# EAGLE schematic ArduinoInterface_v3.1 (EAGLE 9.2.1)
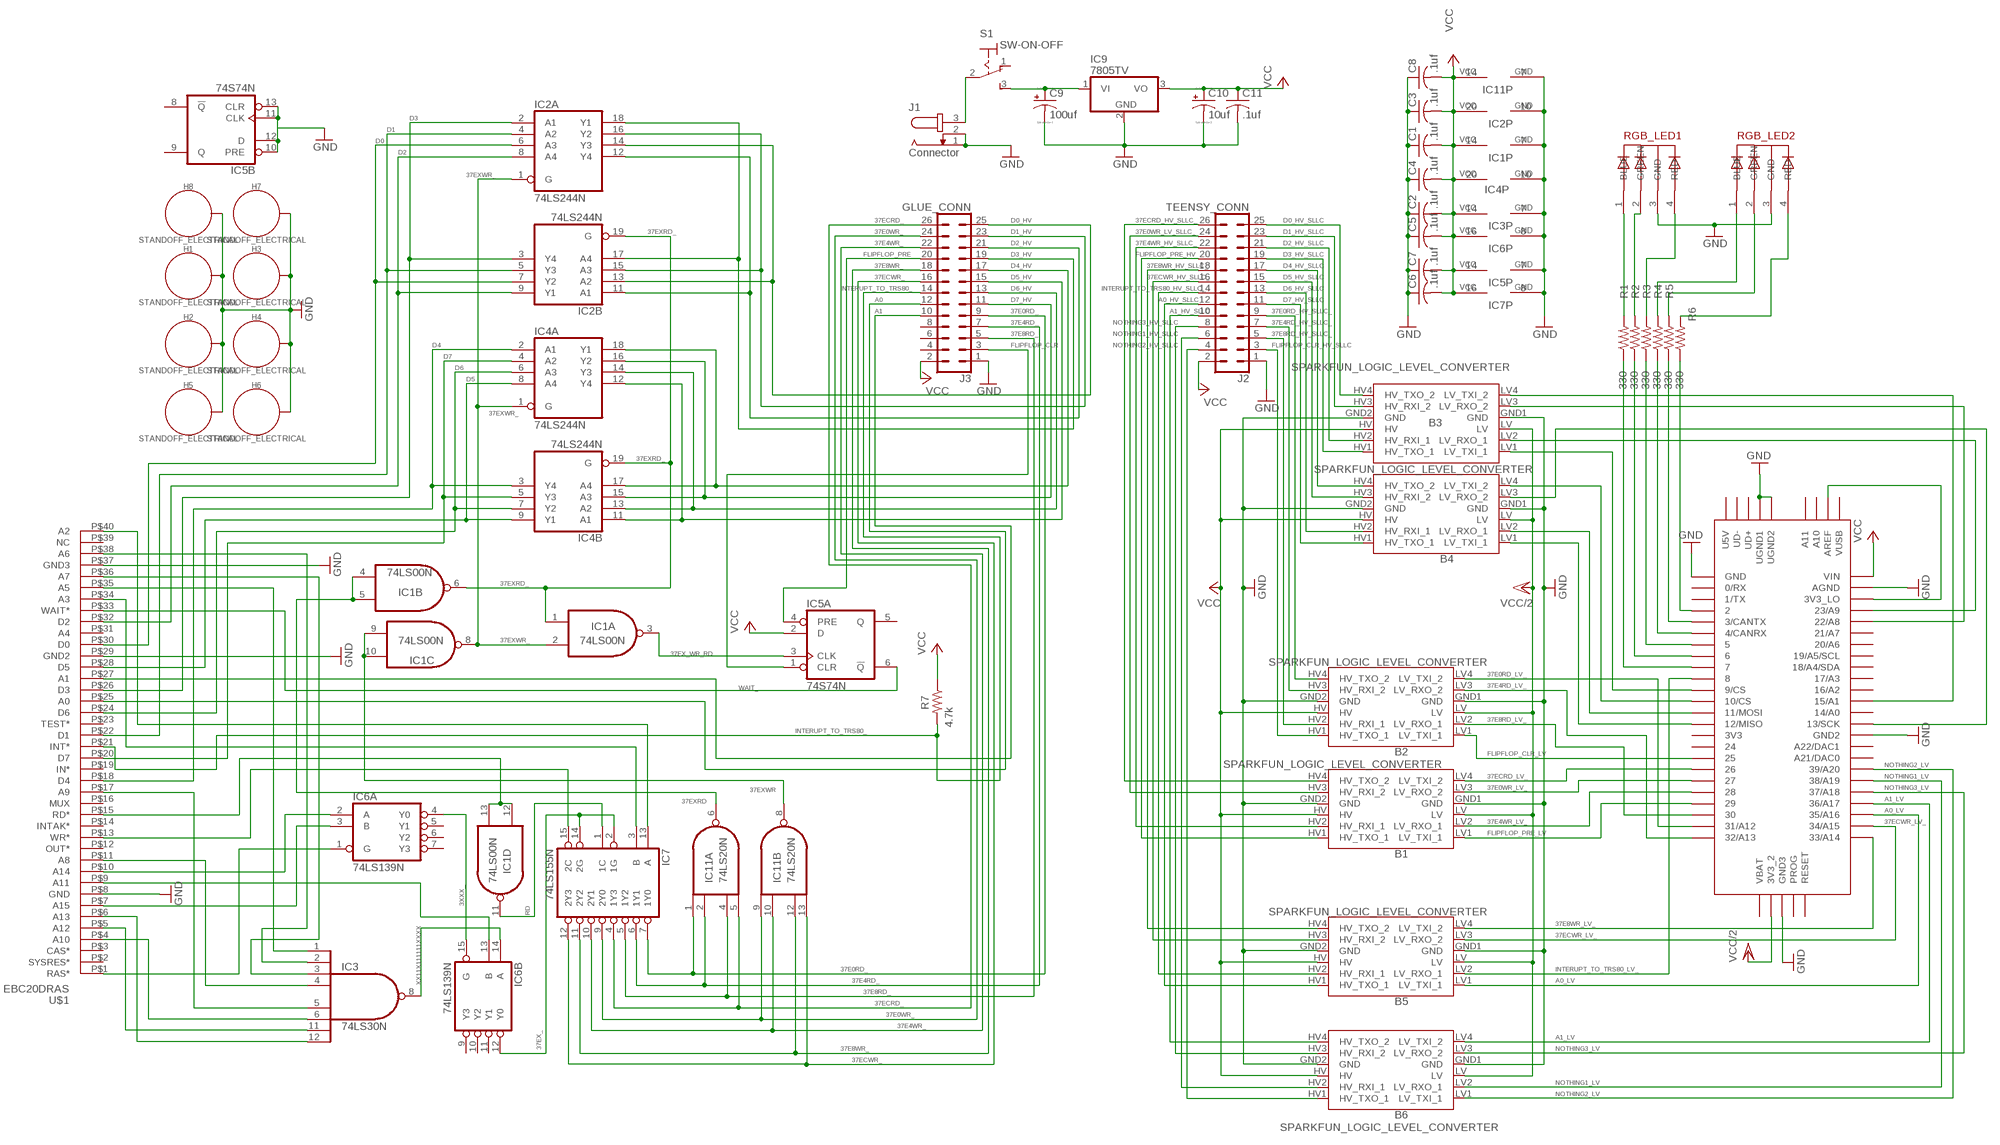
[diagram p0: schematic, sheet 1]

## Parts
B1  SPARKFUN_LOGIC_LEVEL_CONVERTER  [SPARKFUN_LOGIC_LEVEL_CONVERTER]
B2  SPARKFUN_LOGIC_LEVEL_CONVERTER  [SPARKFUN_LOGIC_LEVEL_CONVERTER]
B3  SPARKFUN_LOGIC_LEVEL_CONVERTER  [SPARKFUN_LOGIC_LEVEL_CONVERTER]
B4  SPARKFUN_LOGIC_LEVEL_CONVERTER  [SPARKFUN_LOGIC_LEVEL_CONVERTER]
B5  SPARKFUN_LOGIC_LEVEL_CONVERTER  [SPARKFUN_LOGIC_LEVEL_CONVERTER]
B6  SPARKFUN_LOGIC_LEVEL_CONVERTER  [SPARKFUN_LOGIC_LEVEL_CONVERTER]
C1  .1uf  C-US025-025X050  [C025-025X050]
C2  .1uf  C-US025-025X050  [C025-025X050]
C3  .1uf  C-US025-025X050  [C025-025X050]
C4  .1uf  C-US025-025X050  [C025-025X050]
C5  .1uf  C-US025-025X050  [C025-025X050]
C6  .1uf  C-US025-025X050  [C025-025X050]
C7  .1uf  C-US025-025X050  [C025-025X050]
C8  .1uf  C-US025-025X050  [C025-025X050]
C9  100uf  CPOL-USE5-6  [E5-6]
C10  10uf  CPOL-USE5-6  [E5-6]
C11  .1uf  C-US025-025X050  [C025-025X050]
H1  STANDOFF_ELECTRICAL  [STANDOFF-ELECTRICAL]
H2  STANDOFF_ELECTRICAL  [STANDOFF-ELECTRICAL]
H3  STANDOFF_ELECTRICAL  [STANDOFF-ELECTRICAL]
H4  STANDOFF_ELECTRICAL  [STANDOFF-ELECTRICAL]
H5  STANDOFF_ELECTRICAL  [STANDOFF-ELECTRICAL]
H6  STANDOFF_ELECTRICAL  [STANDOFF-ELECTRICAL]
H7  STANDOFF_ELECTRICAL  [STANDOFF-ELECTRICAL]
H8  STANDOFF_ELECTRICAL  [STANDOFF-ELECTRICAL]
IC1  74LS00N  [DIL14]
IC2  74LS244N  [DIL20]
IC3  74LS30N  [DIL14]
IC4  74LS244N  [DIL20]
IC5  74S74N  [DIL14]
IC6  74LS139N  [DIL16]
IC7  74LS155N  [DIL16]
IC9  7805TV  [TO220V]
IC11  74LS20N  [DIL14]
J1  Connector  JACK-PLUG0  [SPC4077]
J2  TEENSY_CONN  CONN_13X22X13  [2X13]
J3  GLUE_CONN  CONN_13X22X13  [2X13]
R1  330  R-US_0204/2V  [0204V]
R2  330  R-US_0204/2V  [0204V]
R3  330  R-US_0204/2V  [0204V]
R4  330  R-US_0204/2V  [0204V]
R5  330  R-US_0204/2V  [0204V]
R6  330  R-US_0204/2V  [0204V]
R7  4.7k  R-US_0204/2V  [0204V]
RGB_LED1  5MMRGBLED  [LED5MMRGB]
RGB_LED2  5MMRGBLED  [LED5MMRGB]
S1  SW-ON-OFF  M9040P  [M9040P]
U$1  EBC20DRAS  [EBC20DRAS]
U$2  TEENSY_3.5/3.6  [TEENSY_3.5/3.6]

## Nets
3XXX_: IC6.4(A:Y0) IC6.15(B:G)
9V: C9.+ IC9.1(VI) S1.3(S)
9V_TO_SW: J1.3 S1.2(P)
37E0RD_: IC7.7(1Y0) IC11.1(A:I0) J3.9
37E0RD_HV_SLLC_: B2.HV4(HV_TXO_2) J2.9
37E0RD_LV_: B2.LV4(LV_TXI_2) U$2.31/A12
37E0WR_: IC7.9(2Y0) IC11.9(B:I0) J3.24
37E0WR_LV_: B1.LV3(LV_RXO_2) U$2.27
37E0WR_LV_SLLC_: B1.HV3(HV_RXI_2) J2.24
37E4RD_: IC7.6(1Y1) IC11.2(A:I1) J3.7
37E4RD_HV_SLLC_: B2.HV3(HV_RXI_2) J2.7
37E4RD_LV_: B2.LV3(LV_RXO_2) U$2.32/A13
37E4WR_: IC7.10(2Y1) IC11.10(B:I1) J3.22
37E4WR_HV_SLLC_: B1.HV2(HV_RXI_1) J2.22
37E4WR_LV_: B1.LV2(LV_RXO_1) U$2.28
37E8RD_: IC7.5(1Y2) IC11.4(A:I2) J3.5
37E8RD_HV_SLLC_: B2.HV2(HV_RXI_1) J2.5
37E8RD_LV_: B2.LV2(LV_RXO_1) U$2.30
37E8WR_: IC7.11(2Y2) IC11.12(B:I2) J3.18
37E8WR_HV_SLLC_: B5.HV4(HV_TXO_2) J2.18
37E8WR_LV_: B5.LV4(LV_TXI_2) U$2.33/A14
37ECRD_: IC7.4(1Y3) IC11.5(A:I3) J3.26
37ECRD_HV_SLLC_: B1.HV4(HV_TXO_2) J2.26
37ECRD_LV_: B1.LV4(LV_TXI_2) U$2.26
37ECWR_: IC7.12(2Y3) IC11.13(B:I3) J3.16
37ECWR_HV_SLLC_: B5.HV3(HV_RXI_2) J2.16
37ECWR_LV_: B5.LV3(LV_RXO_2) U$2.34/A15
37EX_: IC6.12(B:Y0) IC7.2(1G) IC7.14(2G)
37EX_WR_RD: IC1.3(A:O) IC5.3(A:CLK)
37EXRD: IC1.4(B:I0) IC1.5(B:I1) IC11.6(A:O)
37EXRD_: IC1.1(A:I0) IC1.6(B:O) IC2.19(B:G) IC4.19(B:G)
37EXWR: IC1.9(C:I0) IC1.10(C:I1) IC11.8(B:O)
37EXWR_: IC1.2(A:I1) IC1.8(C:O) IC2.1(A:G) IC4.1(A:G)
A0: J3.12 U$1.P$25(A0)
A0_HV_SLLC: B5.HV1(HV_TXO_1) J2.12
A0_LV: B5.LV1(LV_TXI_1) U$2.35/A16
A1: J3.10 U$1.P$27(A1)
A1_HV_SLLC: B6.HV4(HV_TXO_2) J2.10
A1_LV: B6.LV4(LV_TXI_2) U$2.36/A17
A2: IC7.13(A) U$1.P$40(A2)
A3: IC7.3(B) U$1.P$34(A3)
A5: IC3.1(I0) U$1.P$35(A5)
A6: IC3.2(I1) U$1.P$38(A6)
A7: IC3.3(I2) U$1.P$36(A7)
A8: IC3.4(I3) U$1.P$11(A8)
A9: IC3.5(I4) U$1.P$17(A9)
A10: IC3.6(I5) U$1.P$4(A10)
A11: IC6.13(B:B) U$1.P$9(A11)
A12: IC3.11(I6) U$1.P$5(A12)
A13: IC3.12(I7) U$1.P$6(A13)
A14: IC6.2(A:A) U$1.P$10(A14)
A15: IC6.3(A:B) U$1.P$7(A15)
D0: IC2.6(A:A3) IC2.7(B:Y2) U$1.P$30(D0)
D0_HV: IC2.13(B:A2) IC2.14(A:Y3) J3.25
D0_HV_SLLC: B3.HV4(HV_TXO_2) J2.25
D0_LV: B3.LV4(LV_TXI_2) U$2.15/A1
D1: IC2.4(A:A2) IC2.5(B:Y3) U$1.P$22(D1)
D1_HV: IC2.15(B:A3) IC2.16(A:Y2) J3.23
D1_HV_SLLC: B3.HV3(HV_RXI_2) J2.23
D1_LV: B3.LV3(LV_RXO_2) U$2.22/A8
D2: IC2.8(A:A4) IC2.9(B:Y1) U$1.P$32(D2)
D2_HV: IC2.11(B:A1) IC2.12(A:Y4) J3.21
D2_HV_SLLC: B3.HV2(HV_RXI_1) J2.21
D2_LV: B3.LV2(LV_RXO_1) U$2.23/A9
D3: IC2.2(A:A1) IC2.3(B:Y4) U$1.P$26(D3)
D3_HV: IC2.17(B:A4) IC2.18(A:Y1) J3.19
D3_HV_SLLC: B3.HV1(HV_TXO_1) J2.19
D3_LV: B3.LV1(LV_TXI_1) U$2.9/CS
D4: IC4.2(A:A1) IC4.3(B:Y4) U$1.P$18(D4)
D4_HV: IC4.17(B:A4) IC4.18(A:Y1) J3.17
D4_HV_SLLC: B4.HV4(HV_TXO_2) J2.17
D4_LV: B4.LV4(LV_TXI_2) U$2.10/CS
D5: IC4.8(A:A4) IC4.9(B:Y1) U$1.P$28(D5)
D5_HV: IC4.11(B:A1) IC4.12(A:Y4) J3.15
D5_HV_SLLC: B4.HV3(HV_RXI_2) J2.15
D5_LV: B4.LV3(LV_RXO_2) U$2.13/SCK
D6: IC4.6(A:A3) IC4.7(B:Y2) U$1.P$24(D6)
D6_HV: IC4.13(B:A2) IC4.14(A:Y3) J3.13
D6_HV_SLLC: B4.HV2(HV_RXI_1) J2.13
D6_LV: B4.LV2(LV_RXO_1) U$2.11/MOSI
D7: IC4.4(A:A2) IC4.5(B:Y3) U$1.P$20(D7)
D7_HV: IC4.15(B:A3) IC4.16(A:Y2) J3.11
D7_HV_SLLC: B4.HV1(HV_TXO_1) J2.11
D7_LV: B4.LV1(LV_TXI_1) U$2.12/MISO
FLIPFLOP_CLR: IC5.1(A:CLR) J3.3
FLIPFLOP_CLR_HV_SLLC: B2.HV1(HV_TXO_1) J2.3
FLIPFLOP_CLR_LV: B2.LV1(LV_TXI_1) U$2.25
FLIPFLOP_PRE: IC5.4(A:PRE) J3.20
FLIPFLOP_PRE_HV: B1.HV1(HV_TXO_1) J2.20
FLIPFLOP_PRE_LV: B1.LV1(LV_TXI_1) U$2.29
GND: B1.GND1(GND) B1.GND2(GND) B2.GND1(GND) B2.GND2(GND) B3.GND1(GND) B3.GND2(GND) B4.GND1(GND) B4.GND2(GND) B5.GND1(GND) B5.GND2(GND) B6.GND1(GND) B6.GND2(GND) C1.1 C2.1 C3.1 C4.1 C5.1 C6.1 C7.1 C8.1 C9.- C10.- C11.2 H1.P1 H2.P1 H3.P1 H4.P1 H5.P1 H6.P1 H7.P1 H8.P1 IC1.7(P:GND) IC2.10(P:GND) IC3.7(GND) IC4.10(P:GND) IC5.7(P:GND) IC5.10(B:PRE) IC5.11(B:CLK) IC5.12(B:D) IC5.13(B:CLR) IC6.8(P:GND) IC7.8(GND) IC9.2(GND) IC11.7(P:GND) J1.1 J1.2 J2.1 J3.1 RGB_LED1.3(GND) RGB_LED2.3(GND) U$1.P$8(GND) U$1.P$29(GND2) U$1.P$37(GND3) U$2.AGND U$2.GND U$2.GND2 U$2.GND3 U$2.UGND1 U$2.UGND2
INTERUPT_TO_TRS80_: J3.14 R7.2 U$1.P$21(INT*)
INTERUPT_TO_TRS80_HV_SLLC_: B5.HV2(HV_RXI_1) J2.14
INTERUPT_TO_TRS80_LV_: B5.LV2(LV_RXO_1) U$2.8
N$1: U$2.3V3_LO U$2.AREF
N$2: R2.2 RGB_LED1.2(GREEN)
N$3: R6.1 U$2.2
N$4: R5.1 U$2.3/CANTX
N$5: R4.1 U$2.4/CANRX
N$6: R3.1 U$2.5
N$7: R2.1 U$2.6
N$8: R1.1 U$2.7
N$10: R1.2 RGB_LED1.1(BLUE)
N$15: R3.2 RGB_LED1.4(RED)
N$19: R4.2 RGB_LED2.1(BLUE)
N$20: R5.2 RGB_LED2.2(GREEN)
N$21: R6.2 RGB_LED2.4(RED)
NOTHING1_HV_SLLC: B6.HV2(HV_RXI_1) J2.6
NOTHING1_LV: B6.LV2(LV_RXO_1) U$2.38/A19
NOTHING2_HV_SLLC: B6.HV1(HV_TXO_1) J2.4
NOTHING2_LV: B6.LV1(LV_TXI_1) U$2.39/A20
NOTHING3_HV_SLLC: B6.HV3(HV_RXI_2) J2.8
NOTHING3_LV: B6.LV3(LV_RXO_2) U$2.37/A18
RAS_: IC6.1(A:G) U$1.P$1(RAS*)
RD: IC1.11(D:O) IC7.1(1C)
RD_: IC1.12(D:I0) IC1.13(D:I1) U$1.P$15(RD*)
VCC: B1.HV B2.HV B3.HV B4.HV B5.HV B6.HV C1.2 C2.2 C3.2 C4.2 C5.2 C6.2 C7.2 C8.2 C10.+ C11.1 IC1.14(P:VCC) IC2.20(P:VCC) IC3.14(VCC) IC4.20(P:VCC) IC5.2(A:D) IC5.14(P:VCC) IC6.16(P:VCC) IC7.16(VCC) IC9.3(VO) IC11.14(P:VCC) J2.2 J3.2 R7.1 U$2.VIN
VCC/2: B1.LV B2.LV B3.LV B4.LV B5.LV B6.LV U$2.3V3_2
WAIT_: IC5.6(A:!Q) U$1.P$33(WAIT*)
WR_: IC7.15(2C) U$1.P$13(WR*)
XX11X111111XXXX: IC3.8(O) IC6.14(B:A)
Unconnected: IC5.5(A:Q) IC5.8(B:!Q) IC5.9(B:Q) IC6.5(A:Y1) IC6.6(A:Y2) IC6.7(A:Y3) IC6.9(B:Y3) IC6.10(B:Y2) IC6.11(B:Y1) J3.4 J3.6 J3.8 S1.1(O) U$1.P$2(SYSRES*) U$1.P$3(CAS*) U$1.P$12(OUT*) U$1.P$14(INTAK*) U$1.P$16(MUX) U$1.P$19(IN*) U$1.P$23(TEST*) U$1.P$31(A4) U$1.P$39(NC) U$2.0/RX U$2.1/TX U$2.3V3 U$2.14/A0 U$2.16/A2 U$2.17/A3 U$2.18/A4/SDA U$2.19/A5/SCL U$2.20/A6 U$2.21/A7 U$2.21/DAC0(A21/DAC0) U$2.24 U$2.A10 U$2.A11 U$2.A22/DAC1 U$2.PROG U$2.RESET U$2.U5V U$2.UD+ U$2.UD- U$2.VBAT U$2.VUSB

## Library data of the parts
B1-B6 = SparkFun-Boards:SPARKFUN_LOGIC_LEVEL_CONVERTER: SparkFun Logic Level Converter -Bi-Directional This is the mechnical outline for the 3.3V - 5V bi directional logic level converter. *Note, the "LOCK" Package has the header pins staggered by an offset of 5 mils (off center line), so that when you slide a row of standard 0.1" headers into the PTH pads, it will hold position vertically. See the follwing turorial for more information on this type of special footprints: Sneaky Footprints <https://www.sparkfun.com/tutorials/114> SparkFun Products: SparkFun Logic Level Converter - Bi-Directional <https://www.sparkfun.com/products/12009>
C1-C8 C11 = adafruit:C-US: CAPACITOR, American symbol
C9 C10 = resistor:CPOL-US: POLARIZED CAPACITOR, American symbol
H1-H8 = SparkFun-Hardware:STANDOFF_ELECTRICAL: Stand Off Drill holes with an electrical connection. For example, use these to ground your board to a chassis. Example SparkFun Products Screw - Phillips Head (1/4", 4-40, 10 pack) <https://www.sparkfun.com/products/10453> (PRT-10453) Screw - Phillips Head (1/2", 4-40, 10 pack) <https://www.sparkfun.com/products/10452> (PRT-10452) Screw - Phillips Head (3/4", 4-40, 10 pack) <https://www.sparkfun.com/products/10451> (PRT-10451) Screw - Phillips Head (1", 4-40, 10 pack) <https://www.sparkfun.com/products/10450> (PRT-10450)
IC1 = 74xx-us:74*00: Quad 2-input NAND gate
IC2 IC4 = 74xx-us:74*244: Octal BUFFER and LINE DRIVER, 3-state
IC3 = 74xx-us:74*30: 8-input NAND gate
IC5 = 74xx-us:74*74: Dual D type positive edge triggered FLIP FLOP, preset and clear
IC6 = 74xx-us:74*139: Dual 2-line to 4-line DECODER/DEMULTIPLEXER
IC7 = 74xx-us:74*155: Dual 2-line to 4-line data DECODER/DEMULTIPLEXER
IC9 = linear:78*: Positive VOLTAGE REGULATOR Source: http://cache.national.com/ds/LM/LM78L05.pdf http://www.fairchildsemi.com/ds/LM/LM7805.pdf
IC11 = 74xx-us:74*20: Dual 4-input NAND gate
J1 = con-jack:JACK-PLUG: DC POWER JACK Power Jack, DC, Right Angle, Through Hole, Rated 5A at 16VDC, PC Terminals Distributor: Farnell (www.Farnell.de) Drawing: 84N1161.pdf / 84N1162.pdf Manufacturer: SPC Technology (www.spctechnology.com) Type: SPC4077 / SPC 4078; OC_FARNELL: unknown; OC_NEWARK: unknown
J2 J3 = SparkFun-Connectors:CONN_13X2: Multi connection point. Often used as Generic Header-pin footprint for 0.1 inch spaced/style header connections On any of the 0.1 inch spaced packages, you can populate with these: Break Away Headers - Straight <https://www.sparkfun.com/products/116> (PRT-00116) Break Away Male Headers - Right Angle <https://www.sparkfun.com/products/553> (PRT-00553) Female Headers <https://www.sparkfun.com/products/115> (PRT-00115) Break Away Headers - Machine Pin <https://www.sparkfun.com/products/117> (PRT-00117) Break Away Female Headers - Swiss Machine Pin <https://www.sparkfun.com/products/743> (PRT-00743)
R1-R7 = resistor:R-US_: RESISTOR, American symbol
RGB_LED1 RGB_LED2 = adafruit:5MMRGBLED
S1 = switch:M9040P: TOGGLE SWITCH Marquardt
U$1 = TMS99:EBC20DRAS
U$2 = Teensy356:TEENSY_3.5/3.6

## Net classes
0 default: width 0.3 mm, clearance 0.05 mm